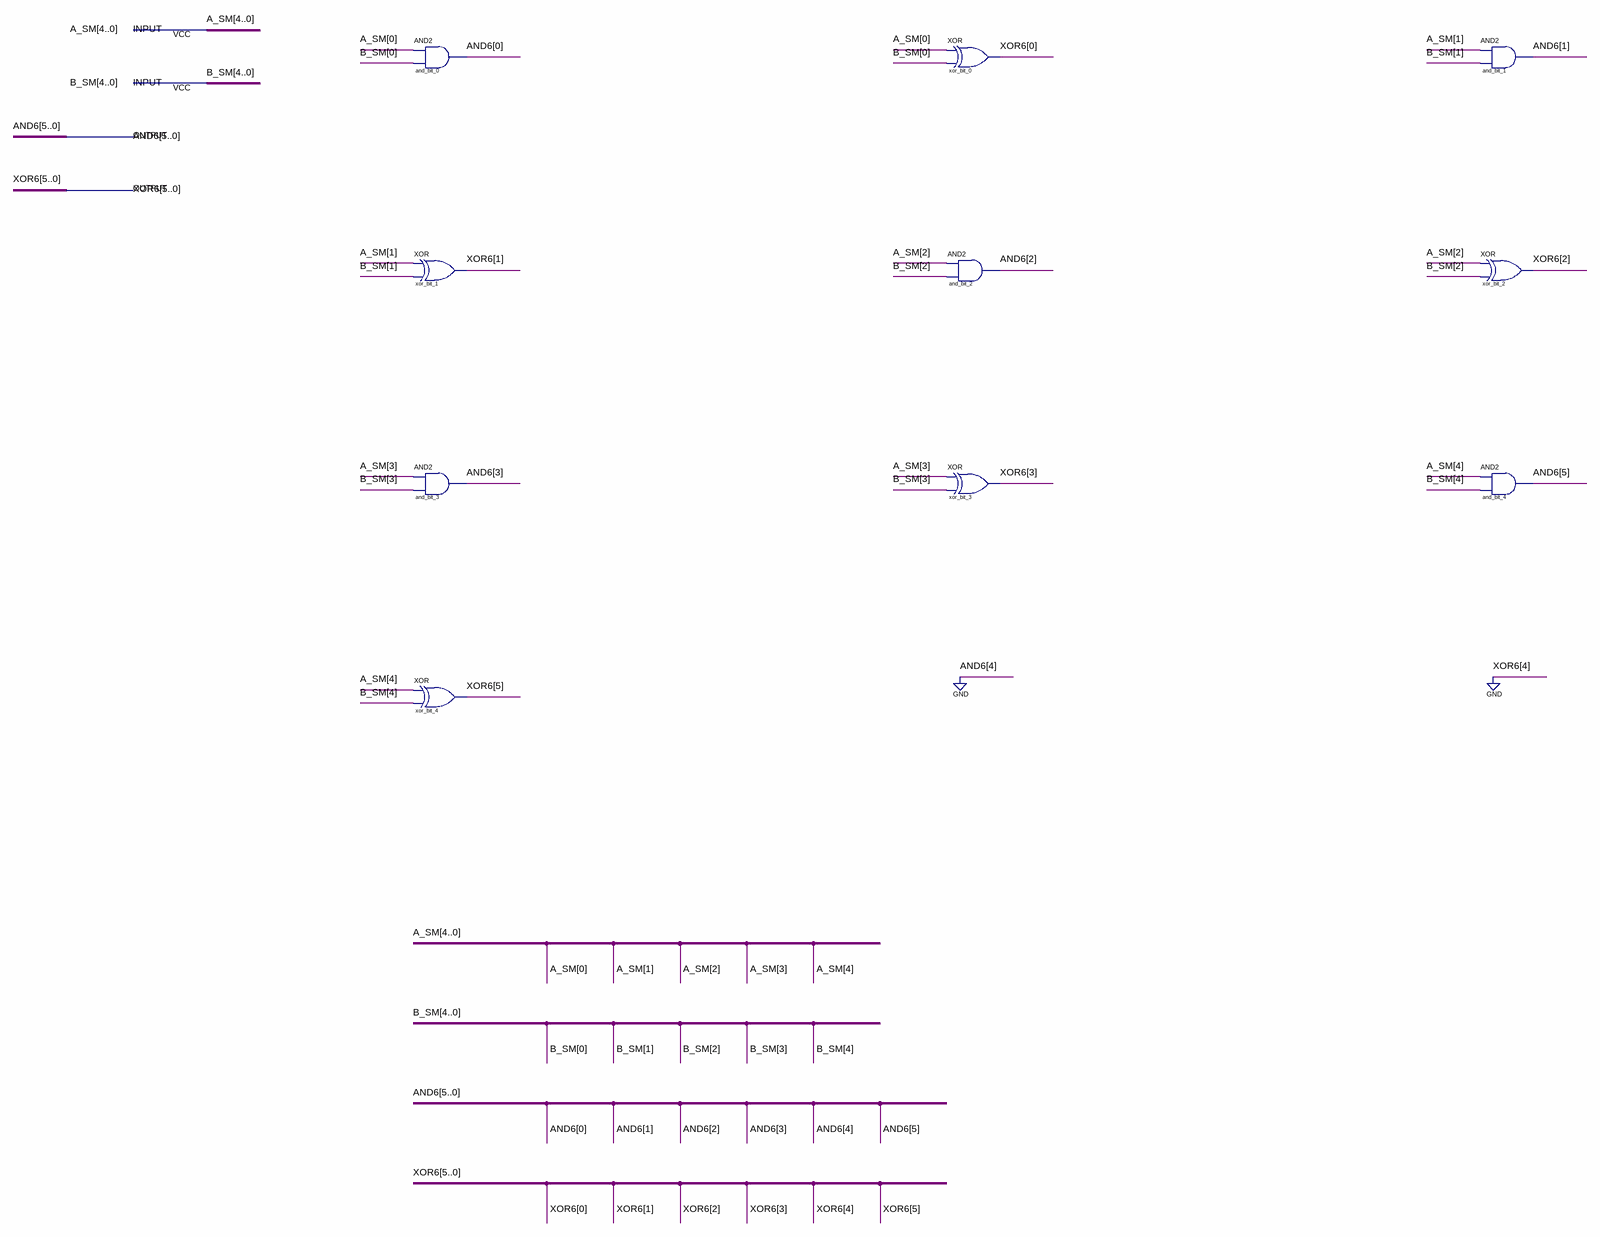
[diagram p0: schematic sheet]
// Quartus schematic logica_5bit.bdf as structural Verilog: 10 symbols, 4 pins
module logica_5bit (
  input  [4:0] A_SM,
  input  [4:0] B_SM,
  output [5:0] AND6,
  output [5:0] XOR6
);

  and and_bit_0 (AND6[0], A_SM[0], B_SM[0]);
  xor xor_bit_1 (XOR6[1], A_SM[1], B_SM[1]);
  and and_bit_3 (AND6[3], A_SM[3], B_SM[3]);
  xor xor_bit_4 (XOR6[5], A_SM[4], B_SM[4]);
  xor xor_bit_0 (XOR6[0], A_SM[0], B_SM[0]);
  and and_bit_2 (AND6[2], A_SM[2], B_SM[2]);
  xor xor_bit_3 (XOR6[3], A_SM[3], B_SM[3]);
  and and_bit_1 (AND6[1], A_SM[1], B_SM[1]);
  xor xor_bit_2 (XOR6[2], A_SM[2], B_SM[2]);
  and and_bit_4 (AND6[5], A_SM[4], B_SM[4]);

  assign AND6[4] = 1'b0;
  assign XOR6[4] = 1'b0;
endmodule
